# EAGLE schematic 10LA.org_4PxU_RPi (EAGLE 6.4)

## Sheet 1 of 3
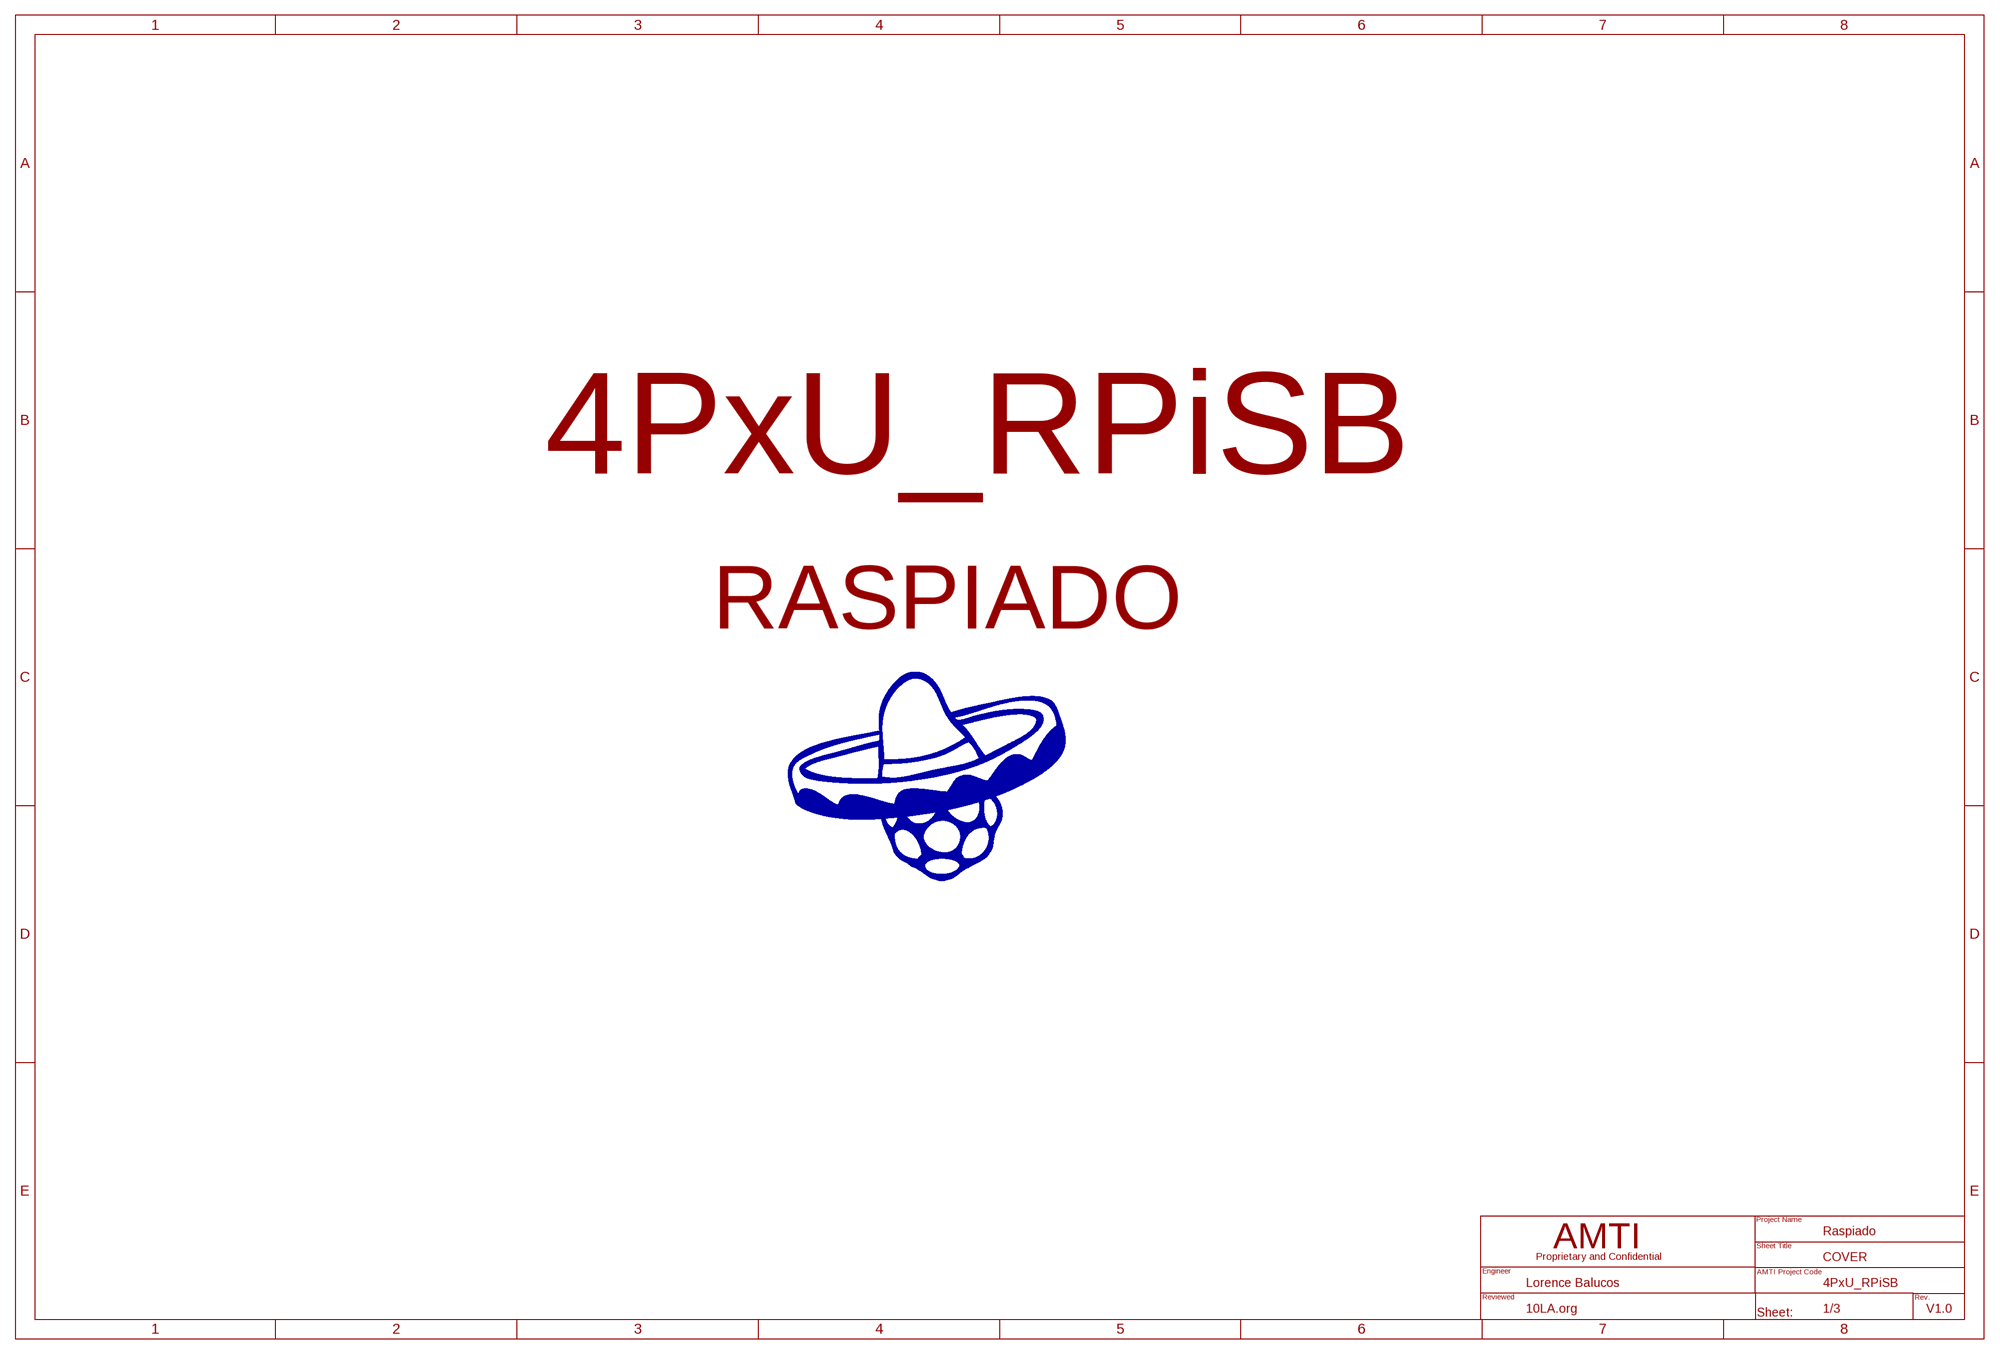
[diagram p0: schematic, sheet 1]

### Notes on the sheet
- 4PxU_RPiSB
- RASPIADO
- Raspiado
- COVER
- Lorence Balucos | 4PxU_RPiSB
- 10LA.org | 1/3 | V1.0

## Sheet 2 of 3
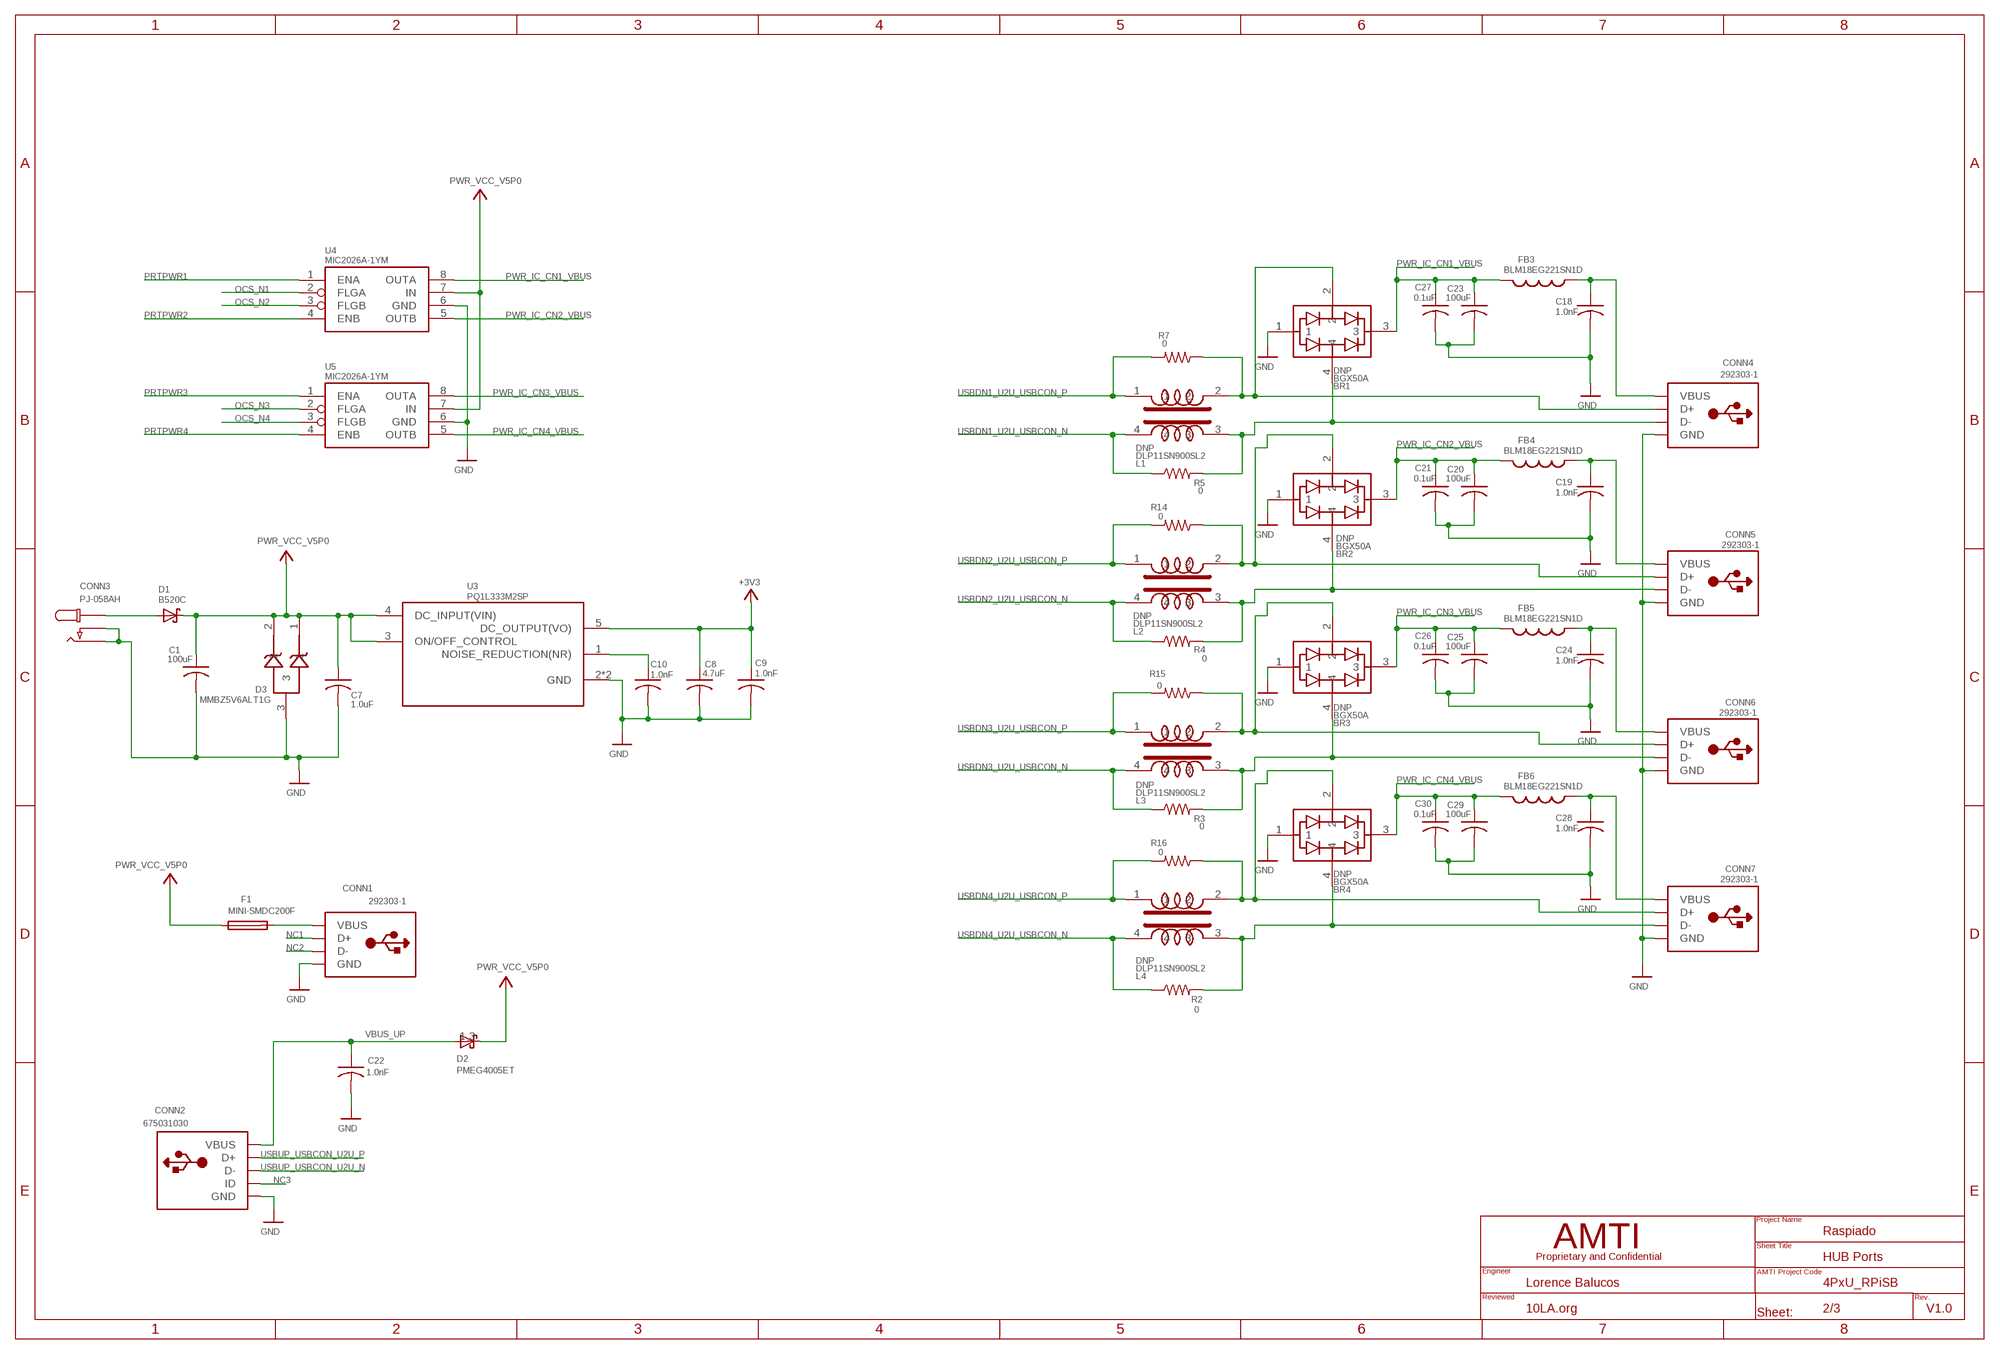
[diagram p1: schematic, sheet 2]

### Parts
BR1  BGX50A  [SOT-143]
BR2  BGX50A  [SOT-143]
BR3  BGX50A  [SOT-143]
BR4  BGX50A  [SOT-143]
C1  100uF  EMZA6R3ADA101ME61G  [RADIAL_SMT]
C7  1.0uF  C-USC0603  [C0603]
C8  4.7uF  C-USC0603  [C0603]
C9  1.0nF  C-USC0402  [0402]
C10  1.0nF  C-USC0402  [0402]
C18  1.0nF  C-USC0402  [0402]
C19  1.0nF  C-USC0402  [0402]
C20  100uF  EMZA6R3ADA101ME61G  [RADIAL_SMT]
C21  0.1uF  C-USC0402  [0402]
C22  1.0nF  C-USC0402  [0402]
C23  100uF  EMZA6R3ADA101ME61G  [RADIAL_SMT]
C24  1.0nF  C-USC0402  [0402]
C25  100uF  EMZA6R3ADA101ME61G  [RADIAL_SMT]
C26  0.1uF  C-USC0402  [0402]
C27  0.1uF  C-USC0402  [0402]
C28  1.0nF  C-USC0402  [0402]
C29  100uF  EMZA6R3ADA101ME61G  [RADIAL_SMT]
C30  0.1uF  C-USC0402  [0402]
CONN1  292303-1  USB_292303-1  [STYLEA,RIGHTANGLE,THROUGH-HOLE]
CONN2  675031030  675031030-USB_MINI-B  [MINI_B]
CONN3  PJ-058AH  [PJ-058AH]
CONN4  292303-1  USB_292303-1  [STYLEA,RIGHTANGLE,THROUGH-HOLE]
CONN5  292303-1  USB_292303-1  [STYLEA,RIGHTANGLE,THROUGH-HOLE]
CONN6  292303-1  USB_292303-1  [STYLEA,RIGHTANGLE,THROUGH-HOLE]
CONN7  292303-1  USB_292303-1  [STYLEA,RIGHTANGLE,THROUGH-HOLE]
D1  B520C  [B520C]
D2  PMEG4005ET  [SOT23]
D3  MMBZ5V6ALT1G  MMBZ_ALT1G  [SOT23]
F1  MINI-SMDC200F  MINI-SMDC-200F  [MINI-SMDC200F]
FB3  BLM18EG221SN1D  [C0603]
FB4  BLM18EG221SN1D  [C0603]
FB5  BLM18EG221SN1D  [C0603]
FB6  BLM18EG221SN1D  [C0603]
L1  DLP11SN900SL2  [0504]
L2  DLP11SN900SL2  [0504]
L3  DLP11SN900SL2  [0504]
L4  DLP11SN900SL2  [0504]
R2  0  R-US_R0402  [R0402]
R3  0  R-US_R0402  [R0402]
R4  0  R-US_R0402  [R0402]
R5  0  R-US_R0402  [R0402]
R7  0  R-US_R0402  [R0402]
R14  0  R-US_R0402  [R0402]
R15  0  R-US_R0402  [R0402]
R16  0  R-US_R0402  [R0402]
U3  PQ1L333M2SP  [PQ1L333M2SP]
U4  MIC2026A-1YM  [SO_08]
U5  MIC2026A-1YM  [SO_08]

### Nets
+3V3: C8.1 C9.1 U3.5(DC_OUTPUT(VO)) ; also sheet 3
GND: BR1.1 BR2.1 BR3.1 BR4.1 C1.- C7.2 C8.2 C9.2 C10.2 C18.2 C19.2 C20.- C21.2 C22.2 C23.- C24.2 C25.- C26.2 C27.2 C28.2 C29.- C30.2 CONN1.GND CONN1.GND1(GND) CONN1.GND2(GND) CONN2.GND CONN2.GND1(GND) CONN2.GND2(GND) CONN2.GND3(GND) CONN2.GND4(GND) CONN3.2 CONN3.3 CONN4.GND CONN4.GND1(GND) CONN4.GND2(GND) CONN5.GND CONN5.GND1(GND) CONN5.GND2(GND) CONN6.GND CONN6.GND1(GND) CONN6.GND2(GND) CONN7.GND CONN7.GND1(GND) CONN7.GND2(GND) D3.3 U3.2(GND) U3.P$3(GND) U4.6(GND) U5.6(GND) ; also sheet 3
N$6: C19.1 CONN5.VBUS FB4.1
N$7: BR2.2 CONN5.SIG2(D+) L2.2 R14.1
N$9: CONN3.1 D1.P$1
N$15: C10.1 U3.1(NOISE_REDUCTION(NR))
N$17: C18.1 CONN4.VBUS FB3.1
N$18: BR1.2 CONN4.SIG2(D+) L1.2 R7.1
N$19: CONN1.VBUS F1.2
N$25: C24.1 CONN6.VBUS FB5.1
N$27: BR3.2 CONN6.SIG2(D+) L3.2 R15.1
N$29: C28.1 CONN7.VBUS FB6.1
N$30: BR4.2 CONN7.SIG2(D+) L4.2 R16.1
NC1: CONN1.SIG2(D+)
NC2: CONN1.SIG1(D-)
NC3: CONN2.ID
OCS_N1: U4.2(FLGA) ; also sheet 3
OCS_N2: U4.3(FLGB) ; also sheet 3
OCS_N3: U5.2(FLGA) ; also sheet 3
OCS_N4: U5.3(FLGB) ; also sheet 3
PRTPWR1: U4.1(ENA) ; also sheet 3
PRTPWR2: U4.4(ENB) ; also sheet 3
PRTPWR3: U5.1(ENA) ; also sheet 3
PRTPWR4: U5.4(ENB) ; also sheet 3
PWR_IC_CN1_VBUS: BR1.3 C23.+ C27.1 FB3.2 U4.8(OUTA)
PWR_IC_CN2_VBUS: BR2.3 C20.+ C21.1 FB4.2 U4.5(OUTB)
PWR_IC_CN3_VBUS: BR3.3 C25.+ C26.1 FB5.2 U5.8(OUTA)
PWR_IC_CN4_VBUS: BR4.3 C29.+ C30.1 FB6.2 U5.5(OUTB)
USBDN1_U2U_USBCON_N: L1.4 R5.1 ; also sheet 3
USBDN1_U2U_USBCON_P: L1.1 R7.2 ; also sheet 3
USBDN1_U2U_USBCON_P2: BR4.4 CONN7.SIG1(D-) L4.3 R2.2
USBDN1_U2U_USBCON_P3: BR3.4 CONN6.SIG1(D-) L3.3 R3.2
USBDN1_U2U_USBCON_P4: BR2.4 CONN5.SIG1(D-) L2.3 R4.2
USBDN1_U2U_USBCON_P5: BR1.4 CONN4.SIG1(D-) L1.3 R5.2
USBDN2_U2U_USBCON_N: L2.4 R4.1 ; also sheet 3
USBDN2_U2U_USBCON_P: L2.1 R14.2 ; also sheet 3
USBDN3_U2U_USBCON_N: L3.4 R3.1 ; also sheet 3
USBDN3_U2U_USBCON_P: L3.1 R15.2 ; also sheet 3
USBDN4_U2U_USBCON_N: L4.4 R2.1 ; also sheet 3
USBDN4_U2U_USBCON_P: L4.1 R16.2 ; also sheet 3
USBUP_USBCON_U2U_N: CONN2.D- ; also sheet 3
USBUP_USBCON_U2U_P: CONN2.D+ ; also sheet 3
VBUS_UP: C22.1 CONN2.VBUS D2.1 ; also sheet 3
VCC: C1.+ C7.1 D1.P$2 D2.3 D3.1 D3.2 F1.1 U3.3(ON/OFF_CONTROL) U3.4(DC_INPUT(VIN)) U4.7(IN) U5.7(IN) ; supply symbol labelled PWR_VCC_V5P0

### Notes on the sheet
- Raspiado
- HUB Ports
- Lorence Balucos | 4PxU_RPiSB
- 10LA.org | 2/3 | V1.0

## Sheet 3 of 3
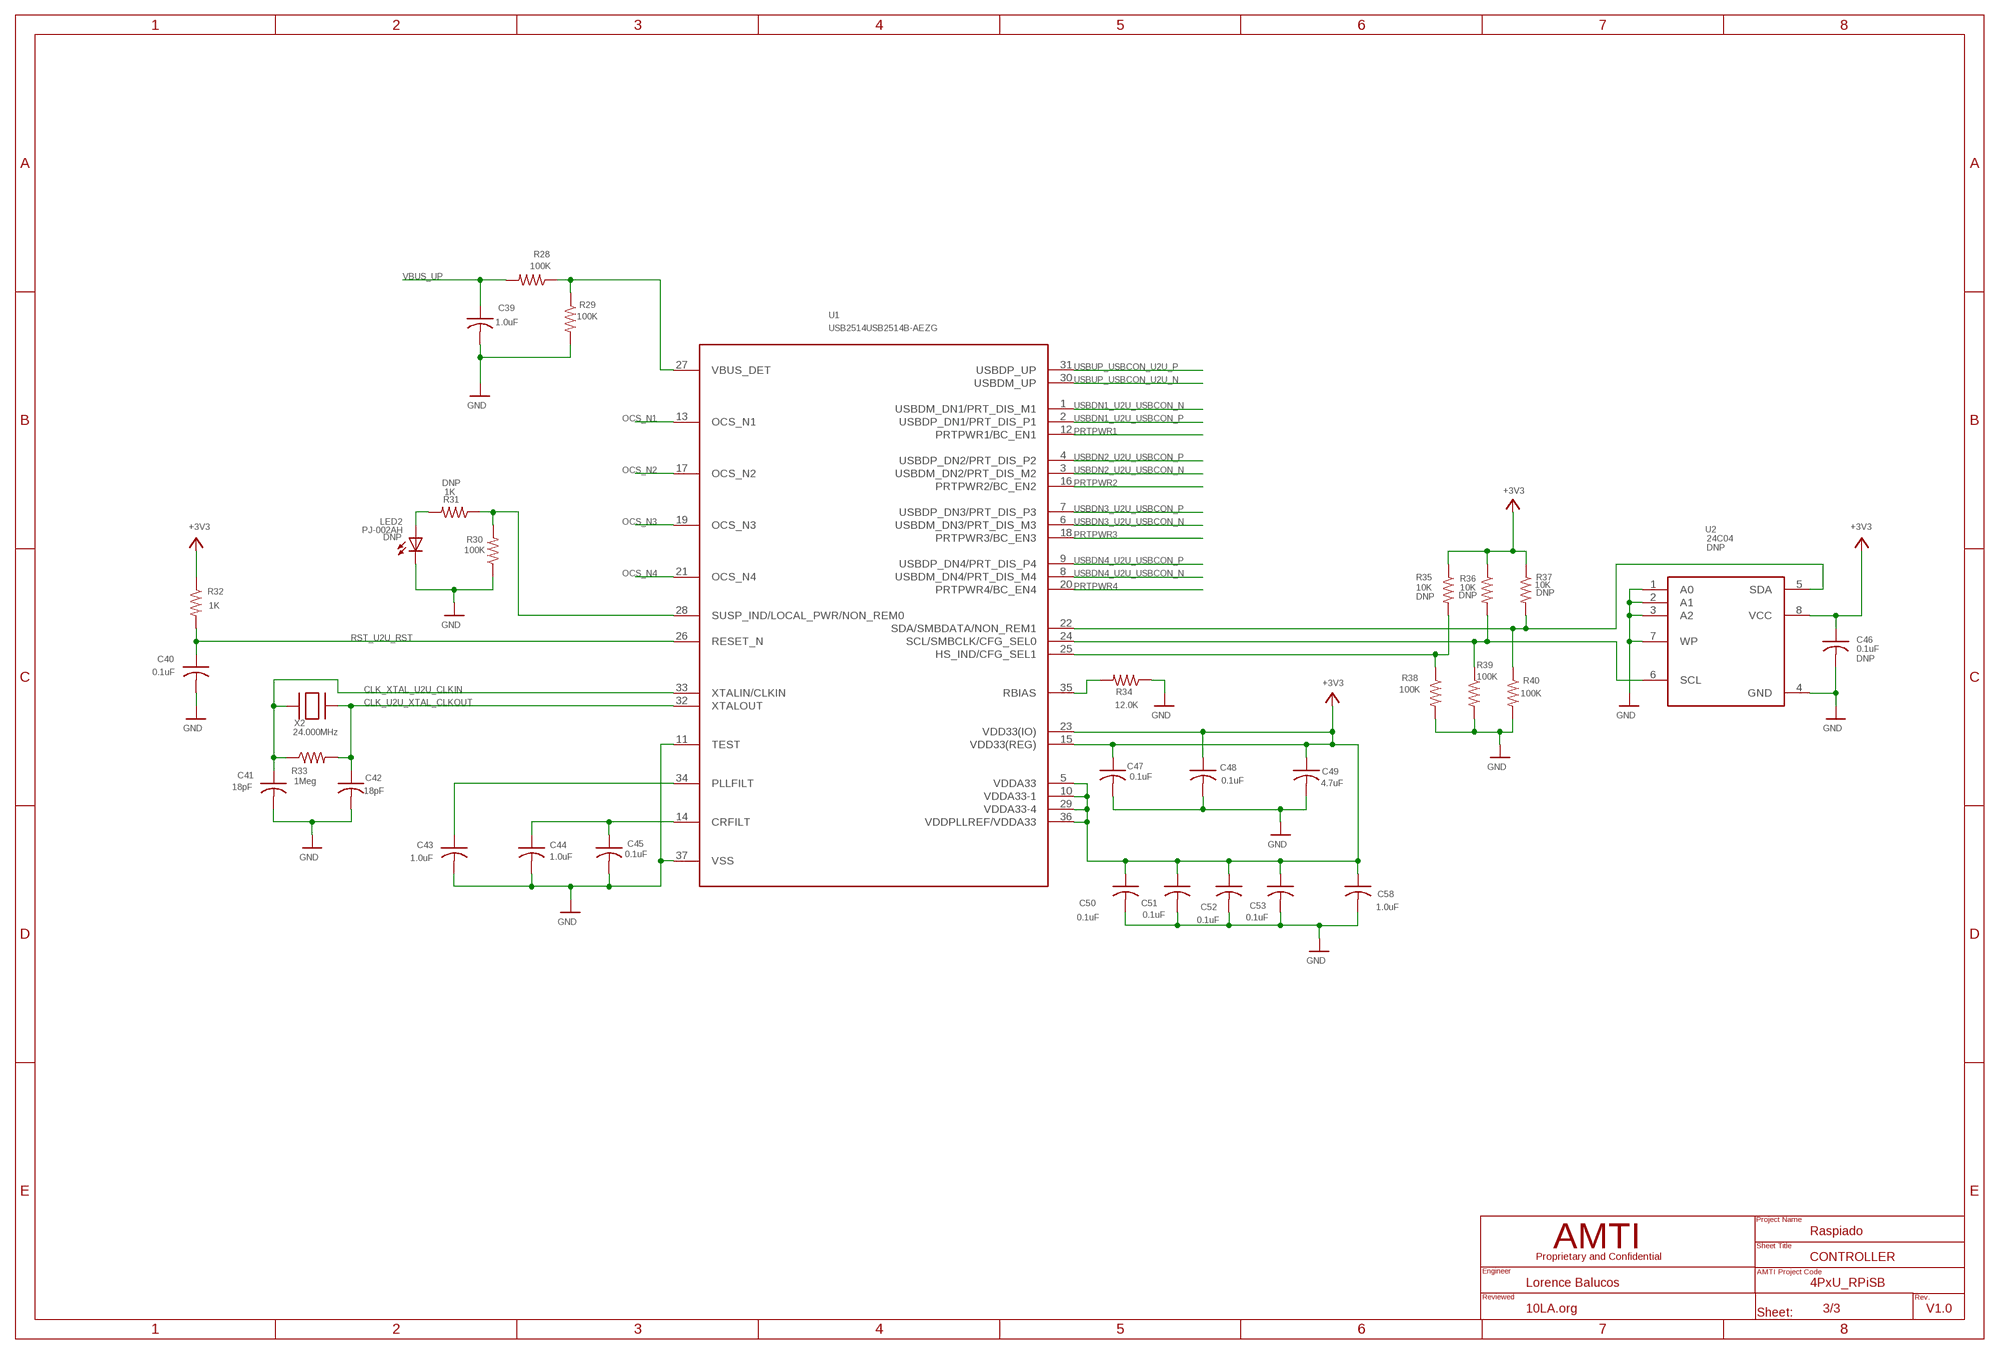
[diagram p2: schematic, sheet 3]

### Parts
C39  1.0uF  C-USC0603  [C0603]
C40  0.1uF  C-USC0402  [0402]
C41  18pF  C-USC0402  [0402]
C42  18pF  C-USC0402  [0402]
C43  1.0uF  C-USC0402  [0402]
C44  1.0uF  C-USC0402  [0402]
C45  0.1uF  C-USC0402  [0402]
C46  0.1uF  C-USC0402  [0402]
C47  0.1uF  C-USC0402  [0402]
C48  0.1uF  C-USC0402  [0402]
C49  4.7uF  C-USC0603  [C0603]
C50  0.1uF  C-USC0402  [0402]
C51  0.1uF  C-USC0402  [0402]
C52  0.1uF  C-USC0402  [0402]
C53  0.1uF  C-USC0402  [0402]
C58  1.0uF  C-USC0603  [C0603]
LED2  PJ-002AH  LEDCHIPLED_0603  [0603]
R28  100K  R-US_R0603  [R0603]
R29  100K  R-US_R0603  [R0603]
R30  100K  R-US_R0603  [R0603]
R31  1K  R-US_R0603  [R0603]
R32  1K  R-US_R0603  [R0603]
R33  1Meg  R-US_R0603  [R0603]
R34  12.0K  R-US_R0603  [R0603]
R35  10K  R-US_R0603  [R0603]
R36  10K  R-US_R0603  [R0603]
R37  10K  R-US_R0603  [R0603]
R38  100K  R-US_R0603  [R0603]
R39  100K  R-US_R0603  [R0603]
R40  100K  R-US_R0603  [R0603]
U1  USB2514USB2514B-AEZG  [QFN36]
U2  24C04  [SO-8]
X2  24.000MHz  HCM49-24.000MABJ-UT  [HC-49SMT]

### Nets
+3V3: C46.1 C47.1 C48.1 C49.1 C50.1 C51.1 C52.1 C53.1 C58.1 R32.1 R35.1 R36.1 R37.1 U1.5(VDDA33) U1.10(VDDA33-1) U1.15(VDD33(REG)) U1.23(VDD33(IO)) U1.29(VDDA33-4) U1.36(VDDPLLREF/VDDA33) U2.8(VCC) ; also sheet 2
CLK_U2U_XTAL_CLKOUT: C42.1 R33.2 U1.32(XTALOUT) X2.2
CLK_XTAL_U2U_CLKIN: C41.1 R33.1 U1.33(XTALIN/CLKIN) X2.1
CRFILT: C44.1 C45.1 U1.14(CRFILT)
GND: C39.2 C40.2 C41.2 C42.2 C43.2 C44.2 C45.2 C46.2 C47.2 C48.2 C49.2 C50.2 C51.2 C52.2 C53.2 C58.2 LED2.C R29.2 R30.1 R34.1 R38.2 R39.2 R40.2 U1.11(TEST) U1.37(VSS) U2.1(A0) U2.2(A1) U2.3(A2) U2.4(GND) U2.7(WP) ; also sheet 2
N$37: LED2.A R31.2
OCS_N1: U1.13(OCS_N1) ; also sheet 2
OCS_N2: U1.17(OCS_N2) ; also sheet 2
OCS_N3: U1.19(OCS_N3) ; also sheet 2
OCS_N4: U1.21(OCS_N4) ; also sheet 2
PLLFILT: C43.1 U1.34(PLLFILT)
PRTPWR1: U1.12(PRTPWR1/BC_EN1) ; also sheet 2
PRTPWR2: U1.16(PRTPWR2/BC_EN2) ; also sheet 2
PRTPWR3: U1.18(PRTPWR3/BC_EN3) ; also sheet 2
PRTPWR4: U1.20(PRTPWR4/BC_EN4) ; also sheet 2
RBIAS: R34.2 U1.35(RBIAS)
REM0: R30.2 R31.1 U1.28(SUSP_IND/LOCAL_PWR/NON_REM0)
REM1: R37.2 R40.1 U1.22(SDA/SMBDATA/NON_REM1) U2.5(SDA)
RST_U2U_RST: C40.1 R32.2 U1.26(RESET_N)
SCL: R36.2 R39.1 U1.24(SCL/SMBCLK/CFG_SEL0) U2.6(SCL)
SEL1: R35.2 R38.1 U1.25(HS_IND/CFG_SEL1)
USBDN1_U2U_USBCON_N: U1.1(USBDM_DN1/PRT_DIS_M1) ; also sheet 2
USBDN1_U2U_USBCON_P: U1.2(USBDP_DN1/PRT_DIS_P1) ; also sheet 2
USBDN2_U2U_USBCON_N: U1.3(USBDM_DN2/PRT_DIS_M2) ; also sheet 2
USBDN2_U2U_USBCON_P: U1.4(USBDP_DN2/PRT_DIS_P2) ; also sheet 2
USBDN3_U2U_USBCON_N: U1.6(USBDM_DN3/PRT_DIS_M3) ; also sheet 2
USBDN3_U2U_USBCON_P: U1.7(USBDP_DN3/PRT_DIS_P3) ; also sheet 2
USBDN4_U2U_USBCON_N: U1.8(USBDM_DN4/PRT_DIS_M4) ; also sheet 2
USBDN4_U2U_USBCON_P: U1.9(USBDP_DN4/PRT_DIS_P4) ; also sheet 2
USBUP_USBCON_U2U_N: U1.30(USBDM_UP) ; also sheet 2
USBUP_USBCON_U2U_P: U1.31(USBDP_UP) ; also sheet 2
VBUS_UP: C39.1 R28.2 ; also sheet 2
VBUS_UPSTREAM: R28.1 R29.1 U1.27(VBUS_DET)

### Notes on the sheet
- Raspiado
- CONTROLLER
- Lorence Balucos | 4PxU_RPiSB
- 10LA.org | 3/3 | V1.0

## Library data of the parts
BR1-BR4 = AMTI LIBRARY:BGX50A; DESCRIPTION: Diode, Bridge, Switching, 50v, 140mA, KCAC, SOT-143; LOAD_OPTION: DNP
C1 C20 C23 C25 C29 = AMTI LIBRARY:EMZA6R3ADA101ME61G: Capacitor, Low ESR, 100uF, 6.3VDC, 20%, Aluminum, Radial-SMT, 5mm x 5.8mm; DESCRIPTION: Capacitor, Low ESR, 100uF, 6.3VDC, 20%, Aluminum, Radial-SMT, 5mm x 5.8mm
C7 C39 C43 C44 C58 = AMTI LIBRARY:C-US; DESCRIPTION: Capacitor, 1.0uF, 10%, 6.3V, X5R, 0603
C8 C49 = AMTI LIBRARY:C-US; DESCRIPTION: Capacitor, 4.7uF, 6.3VDC, 20%, X5R, 0603
C9 C10 C18 C19 C22 C24 C28 = AMTI LIBRARY:C-US; DESCRIPTION: Capacitor, 1.0nF, 50VDC, 5%, Standard, 0402
C21 C26 C27 C30 C40 C45 C47 C48 C50-C53 = AMTI LIBRARY:C-US; DESCRIPTION: Capacitor, 0.1uF, 6.3V, 10%, X5R, 0402
C41 C42 = AMTI LIBRARY:C-US; DESCRIPTION: Capacitor, 18pF, 50V, 5%, NPO, 0402
C46 = AMTI LIBRARY:C-US; DESCRIPTION: Capacitor, 0.1uF, 6.3V, 10%, X5R, 0402; LOAD_OPTION: DNP
CONN1 CONN4-CONN7 = AMTI LIBRARY:USB_292303-1: Connector, USB, Style A, Right Angle, Through-hole; DESCRIPTION: Connector, USB, Style A, Right Angle, Through-hole
CONN2 = AMTI LIBRARY:675031030-USB_MINI-B: Connector, 675031030-USB_MINI-B; DESCRIPTION: Connector, 675031030-USB_MINI-B
CONN3 = AMTI LIBRARY:PJ-058AH: CON PWR JCK 2.0 X 5.7MM
D1 = AMTI LIBRARY:B520C: Diode, 5.0A SURFACE MOUNT SCHOTTKY BARRIER RECTIFIER; DESCRIPTION: Diode, 5.0A SURFACE MOUNT SCHOTTKY BARRIER RECTIFIER
D2 = AMTI LIBRARY:PMEG4005ET: Diode ,0.5 A,MEGA Schottky barrier rectifiers,SOT23; DESCRIPTION: Diode ,0.5 A,MEGA Schottky barrier rectifiers,SOT23
D3 = AMTI LIBRARY:MMBZ_ALT1G: Diode, TVS, Arrays 5.6V 225mW Dual Common Anode; DESCRIPTION: Diode, TVS, Arrays 5.6V 225mW Dual Common Anode
F1 = AMTI LIBRARY:MINI-SMDC-200F: Fuse, PPTC 2A 8V 100A; DESCRIPTION: Fuse, PPTC 2A 8V 100A
FB3-FB6 = AMTI LIBRARY:BLM18EG221SN1D: Ferrite Bead, 220 Ohm, 2A, 0.05DCR, 0603; DESCRIPTION: Ferrite Bead, 220 Ohm, 2A, 0.05DCR, 0603
L1-L4 = AMTI LIBRARY:DLP11SN900SL2: Inductor, Common Mode Choke, DLP11SN900SL2, 0504; DESCRIPTION: Inductor, Common Mode Choke, DLP11SN900SL2, 0504; LOAD_OPTION: DNP
LED2 = AMTI LIBRARY:LED: LED CHIPLED 0603; DESCRIPTION: LED, CHIPLED 0603; LOAD_OPTION: DNP
R2-R5 R7 R14-R16 = AMTI LIBRARY:R-US_; DESCRIPTION: Resistor, 0ohm,0402
R28-R30 R38-R40 = AMTI LIBRARY:R-US_; DESCRIPTION: Resistor, 100K, 5%, 1/16W, 0603
R31 = AMTI LIBRARY:R-US_; DESCRIPTION: Resistor, 1K, 5%, 1/16W, 0603; LOAD_OPTION: DNP
R32 = AMTI LIBRARY:R-US_; DESCRIPTION: Resistor, 1K, 5%, 1/16W, 0603
R33 = AMTI LIBRARY:R-US_; DESCRIPTION: Resistor, 1Meg, 5%, 1/16W, 0603
R34 = AMTI LIBRARY:R-US_; DESCRIPTION: Resistor, 12.0K, 1%, 1/16W, 0603
R35-R37 = AMTI LIBRARY:R-US_; DESCRIPTION: Resistor, 10.0K, 1%, 1/16W, 0603; LOAD_OPTION: DNP
U1 = AMTI LIBRARY:USB2514: IC, USB2514B, 4 Port USB 2.0 Hub, QFN36; DESCRIPTION: IC, USB2514B, 4 Port USB 2.0 Hub, QFN36
U2 = AMTI LIBRARY:24C04: IC, EEPROM,3V to 5.5V for ST24x04,; DESCRIPTION: IC, EEPROM,3V to 5.5V for ST24x04,; LOAD_OPTION: DNP
U3 = AMTI LIBRARY:PQ1L333M2SP: IC, EEPROM,3V to 5.5V for ST24x04,; DESCRIPTION: IC, PQ1L333M2SP, Voltage Regulator, 3.3V, 300mA, Low Dropout, 900mW, SOT-89-5
U4 U5 = AMTI LIBRARY:MIC2026*-1Y: IC, MIC2026A-1YM, Power Distribution Switch, SO-8; DESCRIPTION: IC, MIC2026A-1YM, Power Distribution Switch, SO-8
X2 = AMTI LIBRARY:HCM49-24.000MABJ-UT: Crystal, 24.000MHz, 50ppm, 18pF, HC-49SMT; DESCRIPTION: Crystal, 24.000MHz, 50ppm, 18pF, HC-49SMT

## Net classes
0 default: width 0.178 mm, drill 0.4 mm, clearance 0.178 mm